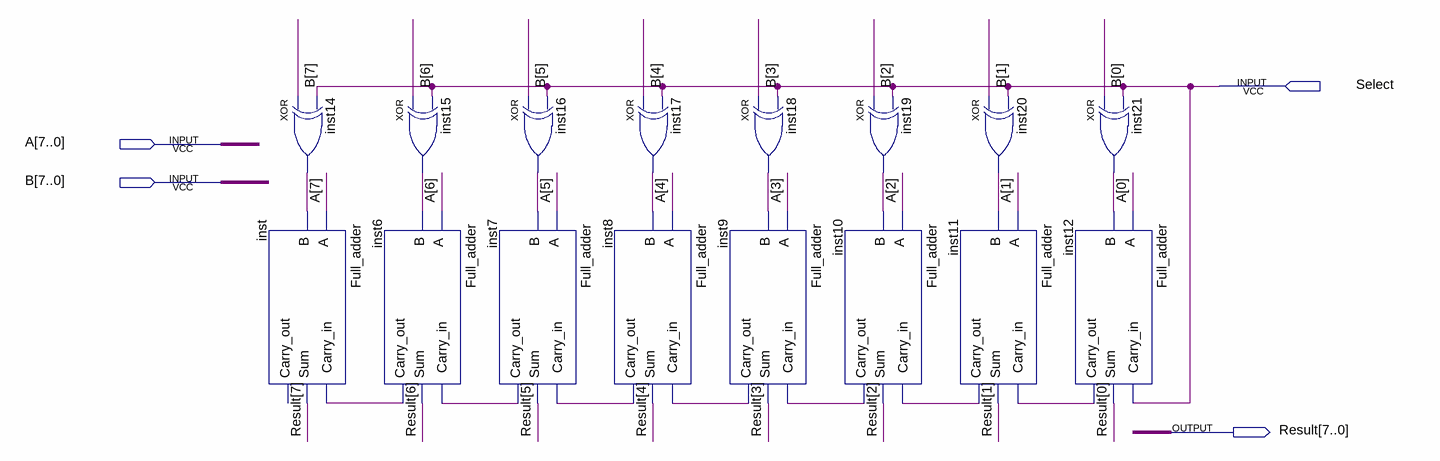
[diagram p0: schematic sheet]
// Quartus schematic add_sub_8bits.bdf as structural Verilog: 16 symbols, 4 pins
module add_sub_8bits (
  input  Select,
  input  [7:0] A,
  input  [7:0] B,
  output [7:0] Result
);

  wire inst6_carry_out, inst7_carry_out, inst8_carry_out, inst9_carry_out, inst10_carry_out,
       inst11_carry_out, inst12_carry_out, inst14_out, inst15_out, inst16_out, inst17_out, inst18_out,
       inst19_out, inst20_out, inst21_out;

  xor inst14 (inst14_out, B[7], Select);
  Full_adder inst (.A(A[7]), .B(inst14_out), .Carry_in(inst6_carry_out), .Sum(Result[7]));  // open: Carry_out
  Full_adder inst6 (.A(A[6]), .B(inst15_out), .Carry_in(inst7_carry_out), .Sum(Result[6]), .Carry_out(inst6_carry_out));
  xor inst15 (inst15_out, B[6], Select);
  xor inst16 (inst16_out, B[5], Select);
  Full_adder inst7 (.A(A[5]), .B(inst16_out), .Carry_in(inst8_carry_out), .Sum(Result[5]), .Carry_out(inst7_carry_out));
  Full_adder inst8 (.A(A[4]), .B(inst17_out), .Carry_in(inst9_carry_out), .Sum(Result[4]), .Carry_out(inst8_carry_out));
  xor inst17 (inst17_out, B[4], Select);
  xor inst18 (inst18_out, B[3], Select);
  Full_adder inst9 (
    .A(A[3]), .B(inst18_out), .Carry_in(inst10_carry_out), .Sum(Result[3]), .Carry_out(inst9_carry_out));
  Full_adder inst10 (
    .A(A[2]), .B(inst19_out), .Carry_in(inst11_carry_out), .Sum(Result[2]), .Carry_out(inst10_carry_out));
  xor inst19 (inst19_out, B[2], Select);
  xor inst20 (inst20_out, B[1], Select);
  Full_adder inst11 (
    .A(A[1]), .B(inst20_out), .Carry_in(inst12_carry_out), .Sum(Result[1]), .Carry_out(inst11_carry_out));
  Full_adder inst12 (.A(A[0]), .B(inst21_out), .Carry_in(Select), .Sum(Result[0]), .Carry_out(inst12_carry_out));
  xor inst21 (inst21_out, B[0], Select);
endmodule
